# Altium project GPIO_Protection.PrjPcb
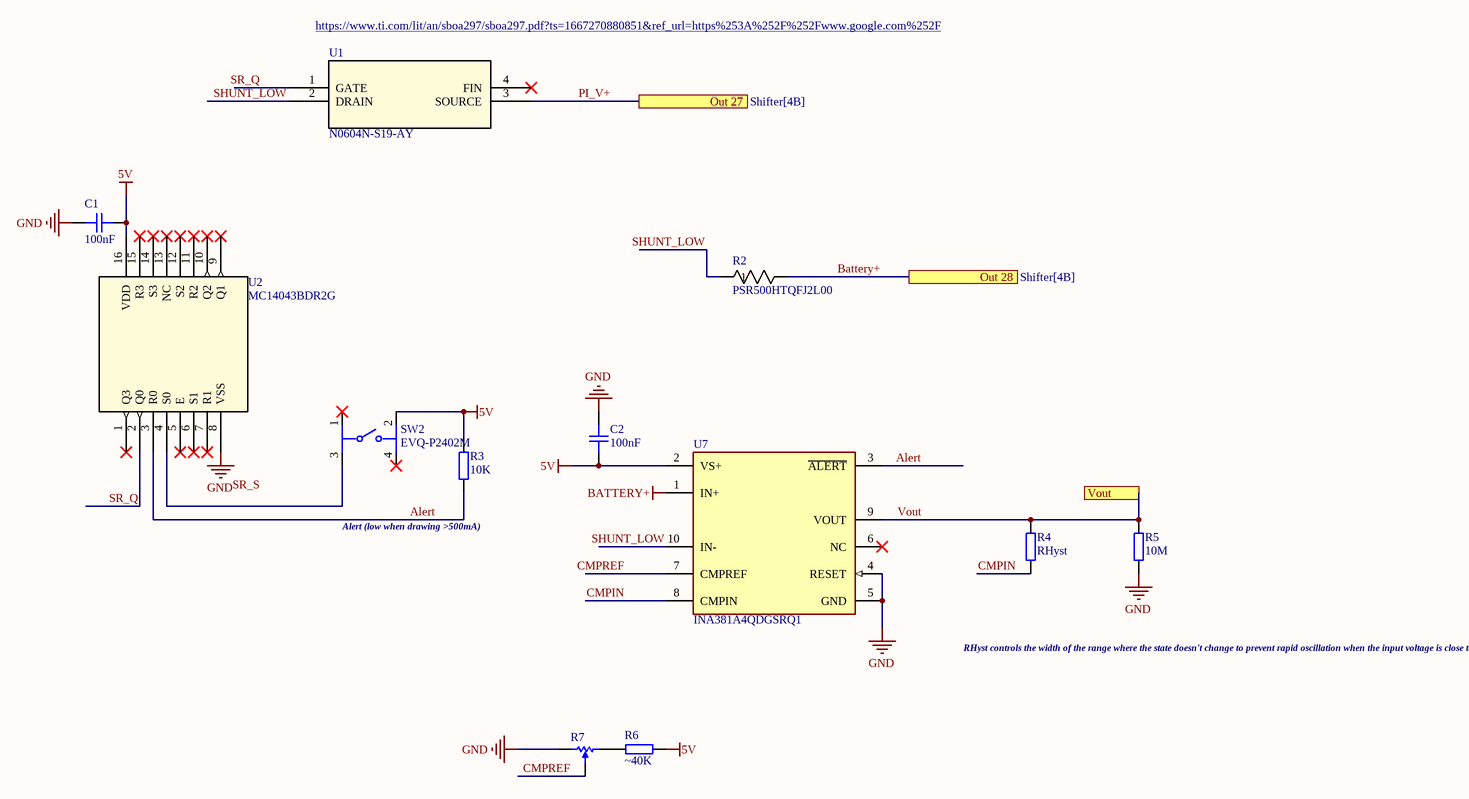
[diagram p0: CurrentSensorLatch.SchDoc]
2 sheets, 72 parts. Net scope: flat (ports and power ports of the same name join across sheets).
Board file: PCB2.PcbDoc
Sheets:
  CurrentSensorLatch.SchDoc
  Shifter.SchDoc

## Sheet CurrentSensorLatch.SchDoc
size B; SheetNumber: 1; SheetTotal: 2

### Parts
C1  100nF  [CAP_0805]
C2  100nF  [CAP_0805]
R2  PSR500HTQFJ2L00  [RES_PSR500_ROM]
R3  10K  [RES_0603]
R4  RHyst  [RES_0603]
R5  10M  [RES_0603]
R6  ~40K  [RES_0603]
R7  35WR10KLFTR  [BI-35WR10KLFTR-3_V]  (value not drawn)
SW2  EVQ-P2402M  [FP-EVQ-P2402M-MFG]
U1  N0604N-S19-AY  [TO-220_REN]
U2  MC14043BDR2G  [SOIC-16_ONS]
U7  INA381A4QDGSRQ1  [FP-DGS0010A-IPC_B]

### Ports
Out 27 (see Shifter[4B]), Out 28 (see Shifter[4B]), Vout

### Nets
5V: C1.2 C2.2 R3.2 R6.2 SW2.2 U2.16(VDD) U7.2(VS+)
Battery+: R2.2 U7.1(IN+) ; port Out 28
GND: C1.1 C2.1 R5.1 R7.1 U2.8(VSS) U7.4(RESET) U7.5(GND)
Alert: R3.1 U2.3(R0) U7.3(~{ALERT})
CMPIN: R4.1 U7.8(CMPIN)
CMPREF: R7.2 U7.7(CMPREF)
PI_V+: U1.3(SOURCE) ; port Out 27  [project net OUT_27]
SHUNT_LOW: R2.1 U1.2(DRAIN) U7.10(IN-)
SR_Q: U1.1(GATE) U2.2(Q0)
Vout: R4.2 R5.2 U7.9(VOUT) ; port Vout
NetR6_1: R6.1 R7.3
NetSW2_3: SW2.3 U2.4(S0)

Not connected (* = marked no-connect by the designer): SW2 1* 4*; U1 4(FIN)*; U2 1(Q3)* 5(E)* 6(S1)* 7(R1)* 9(Q1)* 10(Q2)* 11(R2)* 12(S2)* 13(NC)* 14(S3)* 15(R3)*; U7 6(NC)*

### Notes on the sheet
- https://www.ti.com/lit/an/sboa297/sboa297.pdf?ts=1667270880851&ref_url=https%253A%252F%252Fwww.google.com%252F
- (near R3) Alert (low when drawing >500mA)
- RHyst controls the width of the range where the state doesn't change to prevent rapid oscillation when the input voltage is close to the reference voltage
- Labels drawn without touching a wire or pin: SR_S

### Library data of the parts
C1 C2 = CAP_0805_16V: Capacitor SMD 0805 16V
R2 = PSR500HTQFJ2L00: No Description Available; Mfr_Name: ROHM Semiconductor
R3-R6 = RES_0603: Resistor SMD 0603; Manufacturer: *; Manufacturer Part Number: *; Distributor Link: *
R7 = CMP-009-00041-2: 3 mm Single-Turn Open Frame Surface Mount Cermet Trimming Potentiometer, +/- 25%, 35 W, -40 to 125 degC, 3-Pin SMD, RoHS, Tape and Reel; Manufacturer: BI Technologies; Resistance: 10k; Power: 100mW; Voltage Rating: 50V; Mounting Technology: SM; RoHS Compliant: True; Manufacturer URL: http://www.bi-technologies.net/; Package Quantity: 2000; Package Description: 3-Pin Surface Mount Device, Body 3 x 3.1 mm; Max Operating Temperature: 125°C; Composition: Potentiometer; Packaging: TapeandReel; Datasheet Version: Feb-10; Datasheet URL: http://www.bitechnologies.com/pdfs/35.pdf; Min Operating Temperature: -40°C; Package Reference: 35WR10KLFTR; Case/Package: 35WR10KLFTR; Tolerance: 25%
SW2 = CMP-05618-000087-1: SWITCH TACTILE SPST-NO 0.02A 15V; Mechanical Life: 500000Cycles; Contact Resistance: 100mR; Max Current Rating: 20mA; Throw Configuration: SPST; Switch Function: Off-Mom; Illumination Type: Non-Illuminated; Actuator Color: Natural; Operating Force: 2.4N; Actuator Length: 0.45mm; Switch Travel: 0.25mm; Color: Clear; Size: 3.5mm; Radiation Hardening: No; Mount: Surface Mount; Package Quantity: 1; Length: 3.5mm; Height: 2.1mm; Series: EVQP2; Contact Current Rating: 20mA; Termination: J-Bend; Electrical Life: 500000Cycles; Packaging: Tape and Reel; Current Rating: 20mA; Max Operating Temperature: 85°C; Orientation: Straight; Width: 3.5mm; Max Voltage Rating (DC): 15V; RoHS Compliant: Yes; REACH SVHC: No SVHC; Min Operating Temperature: -40°C; Depth: 5.5mm; Voltage Rating (DC): 15V; Lead Free: Lead Free
U1 = N0604N-S19-AY: No Description Available; Mfr_Name: Renesas Electronics; RefDes: RefDes; Type: Type
U2 = MC14043BDR2G: No Description Available; Mfr_Name: onsemi; RefDes: RefDes; Type: Type
U7 = CMP-04895-000492-1: CURRENT SENSE AMPLIFIER / INA381A4; Accuracy: 1%; Max Operating Temperature: 125°C; Min Operating Temperature: -40°C; Mount: Surface Mount; Series: Automotive, AEC-Q100; Case/Package: VSSOP

## Sheet Shifter.SchDoc
size B; SheetNumber: 2; SheetTotal: 2
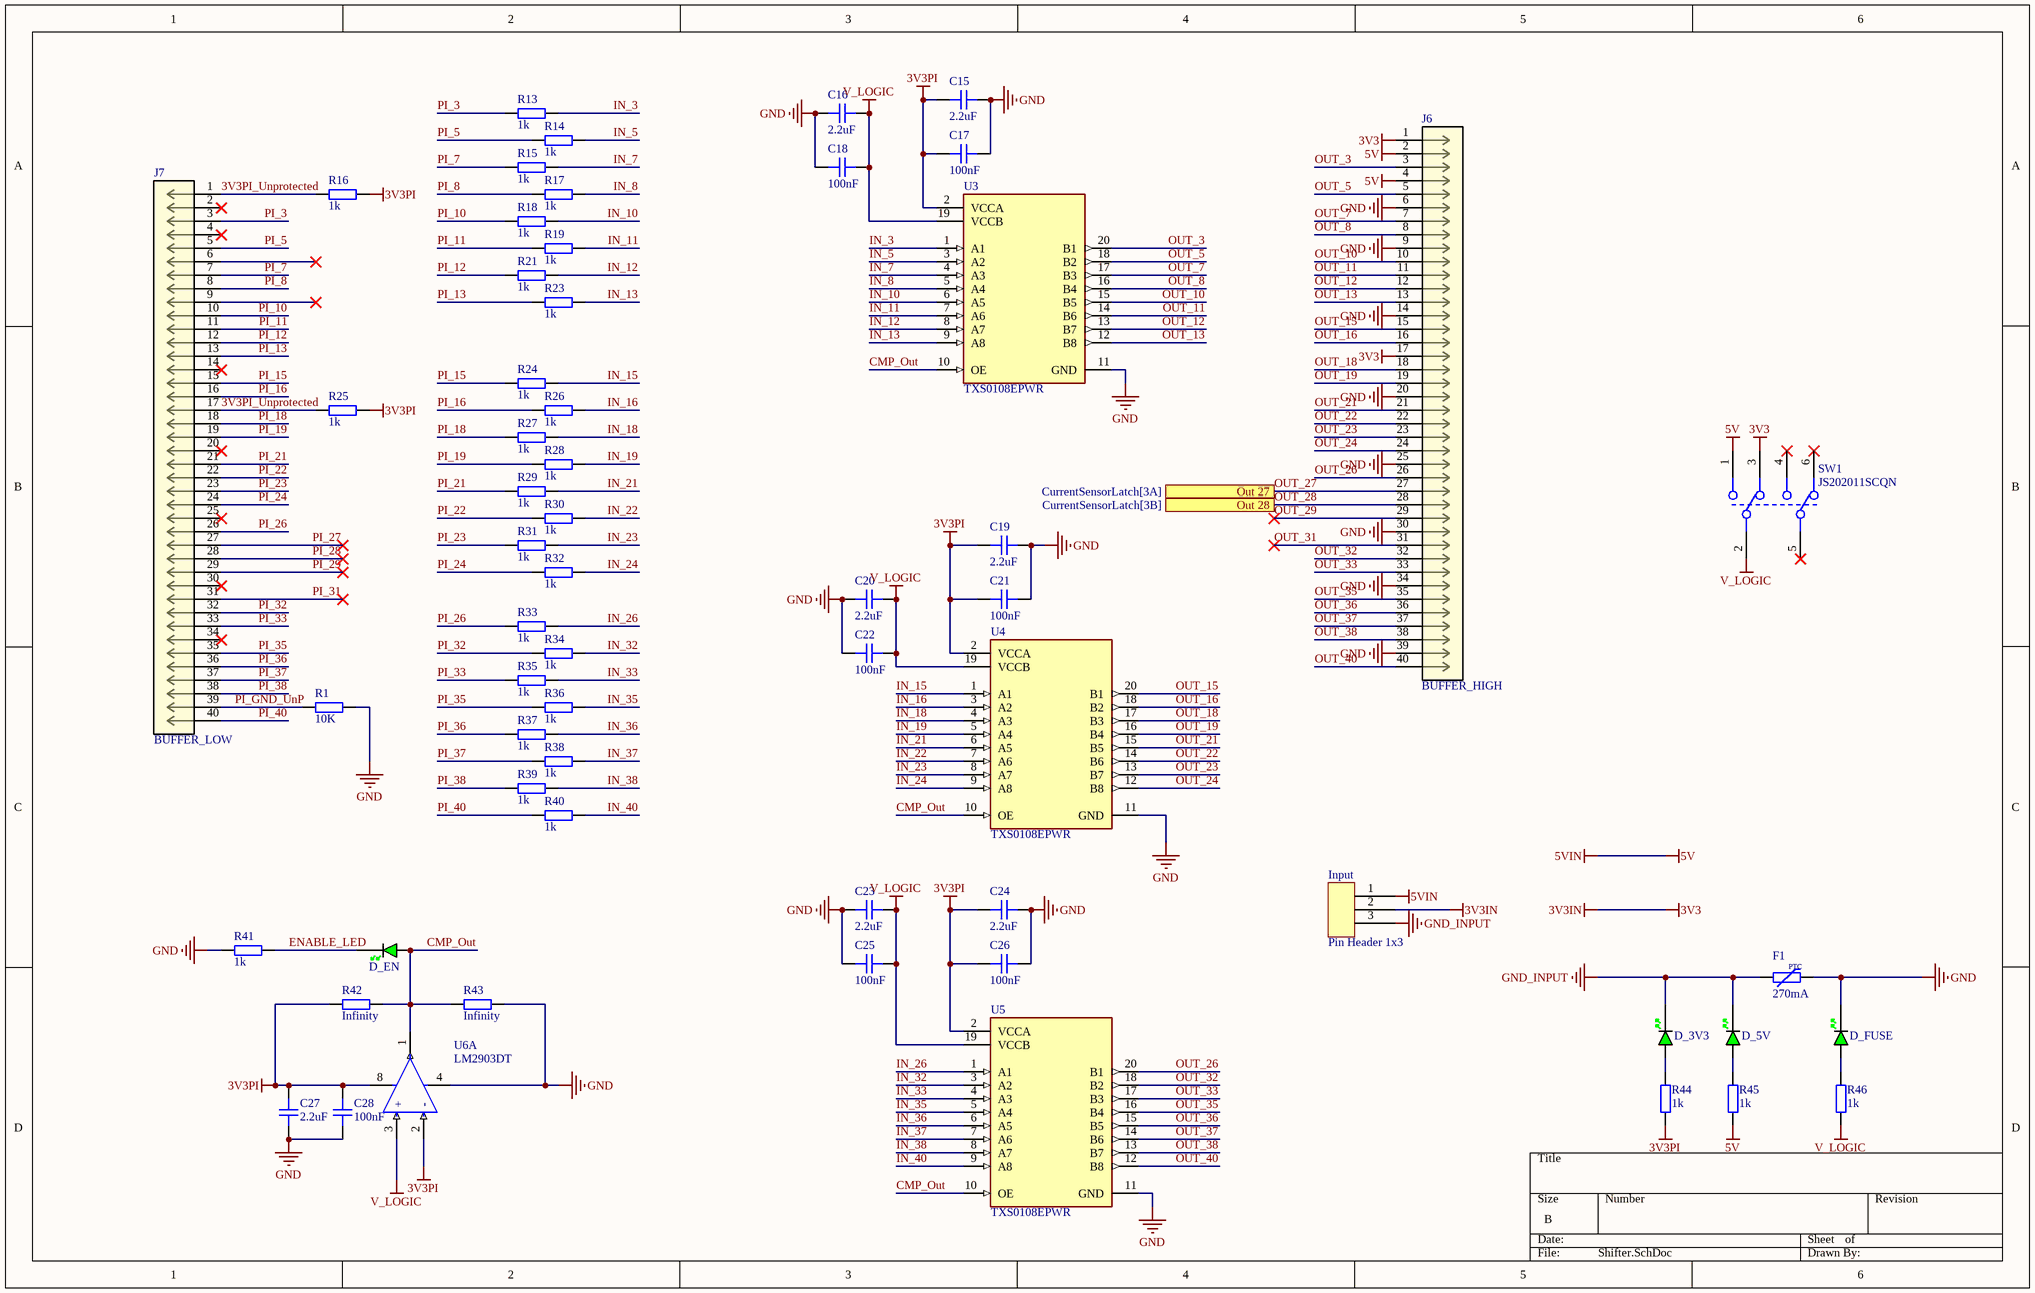
[diagram p1: Shifter.SchDoc]

### Parts
C15  2.2uF  [CAP_0805]
C16  2.2uF  [CAP_0805]
C17  100nF  [CAP_0805]
C18  100nF  [CAP_0805]
C19  2.2uF  [CAP_0805]
C20  2.2uF  [CAP_0805]
C21  100nF  [CAP_0805]
C22  100nF  [CAP_0805]
C23  2.2uF  [CAP_0805]
C24  2.2uF  [CAP_0805]
C25  100nF  [CAP_0805]
C26  100nF  [CAP_0805]
C27  2.2uF  [CAP_0805]
C28  100nF  [CAP_0805]
D_3V3  GREEN  [LED_0603_GREEN]  (value not drawn)
D_5V  GREEN  [LED_0603_GREEN]  (value not drawn)
D_EN  GREEN  [LED_0603_GREEN]  (value not drawn)
D_FUSE  GREEN  [LED_0603_GREEN]  (value not drawn)
F1  270mA  [FUSE_1206]
Input  Pin Header 1x3  [Pin Header 1x3]
J6  BUFFER_HIGH  [CONN_3020-40-0100-00_CNC]
J7  BUFFER_LOW  [CONN_3020-40-0100-00_CNC]
R1  10K  [RES_0603]
R13  1k  [RES_0603]
R14  1k  [RES_0603]
R15  1k  [RES_0603]
R16  1k  [RES_0603]
R17  1k  [RES_0603]
R18  1k  [RES_0603]
R19  1k  [RES_0603]
R21  1k  [RES_0603]
R23  1k  [RES_0603]
R24  1k  [RES_0603]
R25  1k  [RES_0603]
R26  1k  [RES_0603]
R27  1k  [RES_0603]
R28  1k  [RES_0603]
R29  1k  [RES_0603]
R30  1k  [RES_0603]
R31  1k  [RES_0603]
R32  1k  [RES_0603]
R33  1k  [RES_0603]
R34  1k  [RES_0603]
R35  1k  [RES_0603]
R36  1k  [RES_0603]
R37  1k  [RES_0603]
R38  1k  [RES_0603]
R39  1k  [RES_0603]
R40  1k  [RES_0603]
R41  1k  [RES_0603]
R42  Infinity  [RES_0603]
R43  Infinity  [RES_0603]
R44  1k  [RES_0603]
R45  1k  [RES_0603]
R46  1k  [RES_0603]
SW1  JS202011SCQN  [FP-JS202011SCQN-MFG]
U3  TXS0108EPWR  [FP-PW0020A-IPC_C]
U4  TXS0108EPWR  [FP-PW0020A-IPC_C]
U5  TXS0108EPWR  [FP-PW0020A-IPC_C]
U6  LM2903DT  [FP-SO8-SO-A-MFG]  (part A of 2)

### Ports
Out 27 (see CurrentSensorLatch[3A]), Out 28 (see CurrentSensorLatch[3B])

### Nets
3V3: Input.2 J6.1 J6.17 SW1.3  [also labelled 3V3IN]
3V3PI: C15.2 C17.2 C19.2 C21.2 C24.2 C26.2 C27.2 C28.1 R16.2 R25.2 R42.1 R44.1 U3.2(VCCA) U4.2(VCCA) U5.2(VCCA) U6.2(In1-) U6.8(VCC+)
5V: Input.1 J6.2 J6.4 R45.1 SW1.1  [also labelled 5VIN]
GND: C15.1 C16.2 C17.1 C18.2 C19.1 C20.2 C21.1 C22.2 C23.2 C24.1 C25.2 C26.1 C27.1 C28.2 D_FUSE.K F1.2 J6.6 J6.9 J6.14 J6.20 J6.25 J6.30 J6.34 J6.39 R1.2 R41.1 R43.2 U3.11(GND) U4.11(GND) U5.11(GND) U6.4(VCC-)
GND_INPUT: D_3V3.K D_5V.K F1.1 Input.3
OUT_28: J6.28 ; port Out 28  [project net Battery+]
V_LOGIC: C16.1 C18.1 C20.1 C22.1 C23.1 C25.1 R46.1 SW1.2 U3.19(VCCB) U4.19(VCCB) U5.19(VCCB) U6.3(In1+)
3V3PI_Unprotected: J7.1 J7.17 R16.1 R25.1
CMP_Out: D_EN.A R42.2 R43.1 U3.10(OE) U4.10(OE) U5.10(OE) U6.1(Out1)
ENABLE_LED: D_EN.K R41.2
IN_3: R13.2 U3.1(A1)
IN_5: R14.2 U3.3(A2)
IN_7: R15.2 U3.4(A3)
IN_8: R17.2 U3.5(A4)
IN_10: R18.2 U3.6(A5)
IN_11: R19.2 U3.7(A6)
IN_12: R21.2 U3.8(A7)
IN_13: R23.2 U3.9(A8)
IN_15: R24.2 U4.1(A1)
IN_16: R26.2 U4.3(A2)
IN_18: R27.2 U4.4(A3)
IN_19: R28.2 U4.5(A4)
IN_21: R29.2 U4.6(A5)
IN_22: R30.2 U4.7(A6)
IN_23: R31.2 U4.8(A7)
IN_24: R32.2 U4.9(A8)
IN_26: R33.2 U5.1(A1)
IN_32: R34.2 U5.3(A2)
IN_33: R35.2 U5.4(A3)
IN_35: R36.2 U5.5(A4)
IN_36: R37.2 U5.6(A5)
IN_37: R38.2 U5.7(A6)
IN_38: R39.2 U5.8(A7)
IN_40: R40.2 U5.9(A8)
OUT_3: J6.3 U3.20(B1)
OUT_5: J6.5 U3.18(B2)
OUT_7: J6.7 U3.17(B3)
OUT_8: J6.8 U3.16(B4)
OUT_10: J6.10 U3.15(B5)
OUT_11: J6.11 U3.14(B6)
OUT_12: J6.12 U3.13(B7)
OUT_13: J6.13 U3.12(B8)
OUT_15: J6.15 U4.20(B1)
OUT_16: J6.16 U4.18(B2)
OUT_18: J6.18 U4.17(B3)
OUT_19: J6.19 U4.16(B4)
OUT_21: J6.21 U4.15(B5)
OUT_22: J6.22 U4.14(B6)
OUT_23: J6.23 U4.13(B7)
OUT_24: J6.24 U4.12(B8)
OUT_26: J6.26 U5.20(B1)
OUT_27: J6.27 ; port Out 27
OUT_29: J6.29
OUT_31: J6.31
OUT_32: J6.32 U5.18(B2)
OUT_33: J6.33 U5.17(B3)
OUT_35: J6.35 U5.16(B4)
OUT_36: J6.36 U5.15(B5)
OUT_37: J6.37 U5.14(B6)
OUT_38: J6.38 U5.13(B7)
OUT_40: J6.40 U5.12(B8)
PI_3: J7.3 R13.1
PI_5: J7.5 R14.1
PI_7: J7.7 R15.1
PI_8: J7.8 R17.1
PI_10: J7.10 R18.1
PI_11: J7.11 R19.1
PI_12: J7.12 R21.1
PI_13: J7.13 R23.1
PI_15: J7.15 R24.1
PI_16: J7.16 R26.1
PI_18: J7.18 R27.1
PI_19: J7.19 R28.1
PI_21: J7.21 R29.1
PI_22: J7.22 R30.1
PI_23: J7.23 R31.1
PI_24: J7.24 R32.1
PI_26: J7.26 R33.1
PI_27: J7.27
PI_28: J7.28
PI_29: J7.29
PI_31: J7.31
PI_32: J7.32 R34.1
PI_33: J7.33 R35.1
PI_35: J7.35 R36.1
PI_36: J7.36 R37.1
PI_37: J7.37 R38.1
PI_38: J7.38 R39.1
PI_40: J7.40 R40.1
PI_GND_UnP: J7.39 R1.1
NetD_3V3_A: D_3V3.A R44.2
NetD_5V_A: D_5V.A R45.2
NetD_FUSE_A: D_FUSE.A R46.2

Not connected (* = marked no-connect by the designer): J7 2* 4* 6* 9* 14* 20* 25* 30* 34*; SW1 4* 5* 6*

### Notes on the sheet
- (in symbol CMP-12132-000004-1, part A) +; -
- (in symbol FUSE_PPTC_1206) PTC

### Library data of the parts
C15-C28 = CAP_0805_16V: Capacitor SMD 0805 16V
D_3V3 D_5V D_EN D_FUSE = LED_0603_GREEN: LED 0603 GREEN SMD
F1 = FUSE_PPTC_1206: Fuse PPTC SMD 1206 / SMD1206B010TF; Manufacturer: *; Manufacturer Part Number: *
Input = Pin Header 1x3: .1" pitch pin header
J6 J7 = 3020-40-0100-00: No Description Available; Mfr_Name: CNC Tech; RefDes: RefDes; Type: Type
R1 R13-R19 R21 R23-R46 = RES_0603: Resistor SMD 0603; Manufacturer: *; Manufacturer Part Number: *; Distributor Link: *
SW1 = CMP-2000-05087-3: SWITCH SLIDE DPDT 300MA 6V; Switch Function: On-On; Actuator Type: Standard; Switch Travel: 2mm; Actuator Color: Black; Contact Resistance: 70mR; Electrical Life: 5000Cycles; Actuator Material: Nylon; REACH SVHC: No SVHC; Series: JS; Min Operating Temperature: -20°C; Depth: 7.5mm; Housing Material: Nylon; Voltage Rating (DC): 6V; Max Operating Temperature: 85°C; Contact Current Rating: 300mA; Package Quantity: 1; Contact Plating: Silver; Contact Material: Copper Alloy; Throw Configuration: DPDT; Current Rating: 300mA; Orientation: Vertical; Max Current Rating: 300mA; Max Voltage Rating (DC): 6V; Flammability Rating: UL94 V-2; Length: 9mm; Packaging: Tape and Reel; Mount: Surface Mount; Actuator Length: 2mm; Lead Free: Lead Free; Termination: Gull Wing; Radiation Hardening: No
U3-U5 = CMP-2000-04956-2: IC TRNSLTR BIDIRECTIONAL 20TSSOP; Number of Inputs: 8; Supply Current: 8uA; Low Level Output Current: 50mA; Min Supply Voltage: 1.2V; Quiescent Current: 3uA; Output Type: Voltage; Propagation Delay: 4.8ns; Max Supply Voltage: 5.5V; Output Current: 620uA; Turn-On Delay Time: 312ns; Logic Function: Translator; Data Rate: 60Mbps; Rise Time: 6.3ns; High Level Output Current: -50mA; Number of Pins: 20; Packaging: Tape and Reel; Max Operating Temperature: 85°C; Height: 1.15mm; Nominal Supply Current: 8uA; Termination: SMD/SMT; Lead Free: Lead Free; Package Quantity: 1; Number of Bits: 8; Weight: 0.002716oz; Contact Plating: Gold; Series: -; Width: 4.4mm; Radiation Hardening: No; Mount: Surface Mount; Length: 6.5mm; Case/Package: TSSOP; REACH SVHC: No SVHC; RoHS Compliant: Yes; Min Operating Temperature: -40°C; Number of Channels: 8
U6 = CMP-12132-000004-1: IC COMPARATOR LP DUAL 8-SOIC; Manufacturer: STMicroelectronics; Min Supply Voltage: 2V; Number Of Channels: 2; Input Offset Voltage: 1mV; Nominal Supply Current: 0.4-1mA; Output Current Per Channel: 16mA; Response Time: 1.3us; Voltage Gain: 200V/mV; Max Supply Voltage: 36V; Min Dual Supply Voltage: 1V; Standoff Height: 0.1mm; Input Bias Current: 0.025uA; Max Dual Supply Voltage: 18V; Max Junction Temp: +150°C; Height: 1.75mm; Device Class L2: Linear ICs; Temperature Range High: +150°C; Ambient Temperature Range Low: -40°C; Category: IC; Package: SO8-SO-A; Footprint Url: https://www.st.com/content/ccc/resource/technical/document/datasheet/group3/16/9a/68/4c/7d/03/4a/09/DM00396770/files/DM00396770.pdf/jcr:content/translations/en.DM00396770.pdf; Ipc Land Pattern Name: SOIC127P600X175-8; Octopart: https://octopart.com/lm2903dt-stmicroelectronics-428473; ComponentLink2URL: https://www.st.com/content/ccc/resource/technical/document/datasheet/44/f7/9d/99/42/20/45/fd/CD00000534.pdf/files/CD00000534.pdf/jcr:content/translations/en.CD00000534.pdf; Ambient Temperature Range High: +125°C; Device Class L1: Integrated Circuits (ICs); Device Class L3: Comparators; Digikey Description: IC COMPARATOR LP DUAL 8-SOIC; Automotive: No; ComponentLink2Description: Datasheet; Lead Free: Yes; Manufacturer Part Number: LM2903DT; Mouser Description: Analog Comparators Lo-Pwr Dual Voltage; Temperature: to +150°C; RoHS: TRUE

## Nets that join several sheets
5V: CurrentSensorLatch (7 pins), Shifter (5 pins)
Battery+: CurrentSensorLatch (R2.2 U7.1), Shifter (J6.28)
GND: CurrentSensorLatch (7 pins), Shifter (31 pins)
OUT_27: CurrentSensorLatch (U1.3), Shifter (J6.27)